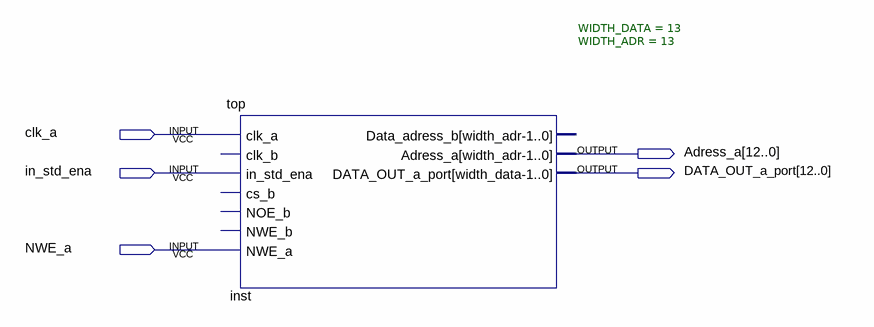
[diagram p0: schematic sheet]
// Quartus schematic tst.bdf as structural Verilog: 1 symbols, 5 pins
module tst (
  input  clk_a,
  input  in_std_ena,
  input  NWE_a,
  output [12:0] Adress_a,
  output [12:0] DATA_OUT_a_port
);

  top #(.WIDTH_DATA(13), .WIDTH_ADR(13)) inst (
    .clk_a(clk_a), .in_std_ena(in_std_ena), .NWE_a(NWE_a), .Adress_a(Adress_a),
    .DATA_OUT_a_port(DATA_OUT_a_port));  // open: clk_b, cs_b, NOE_b, NWE_b, Data_adress_b
endmodule
